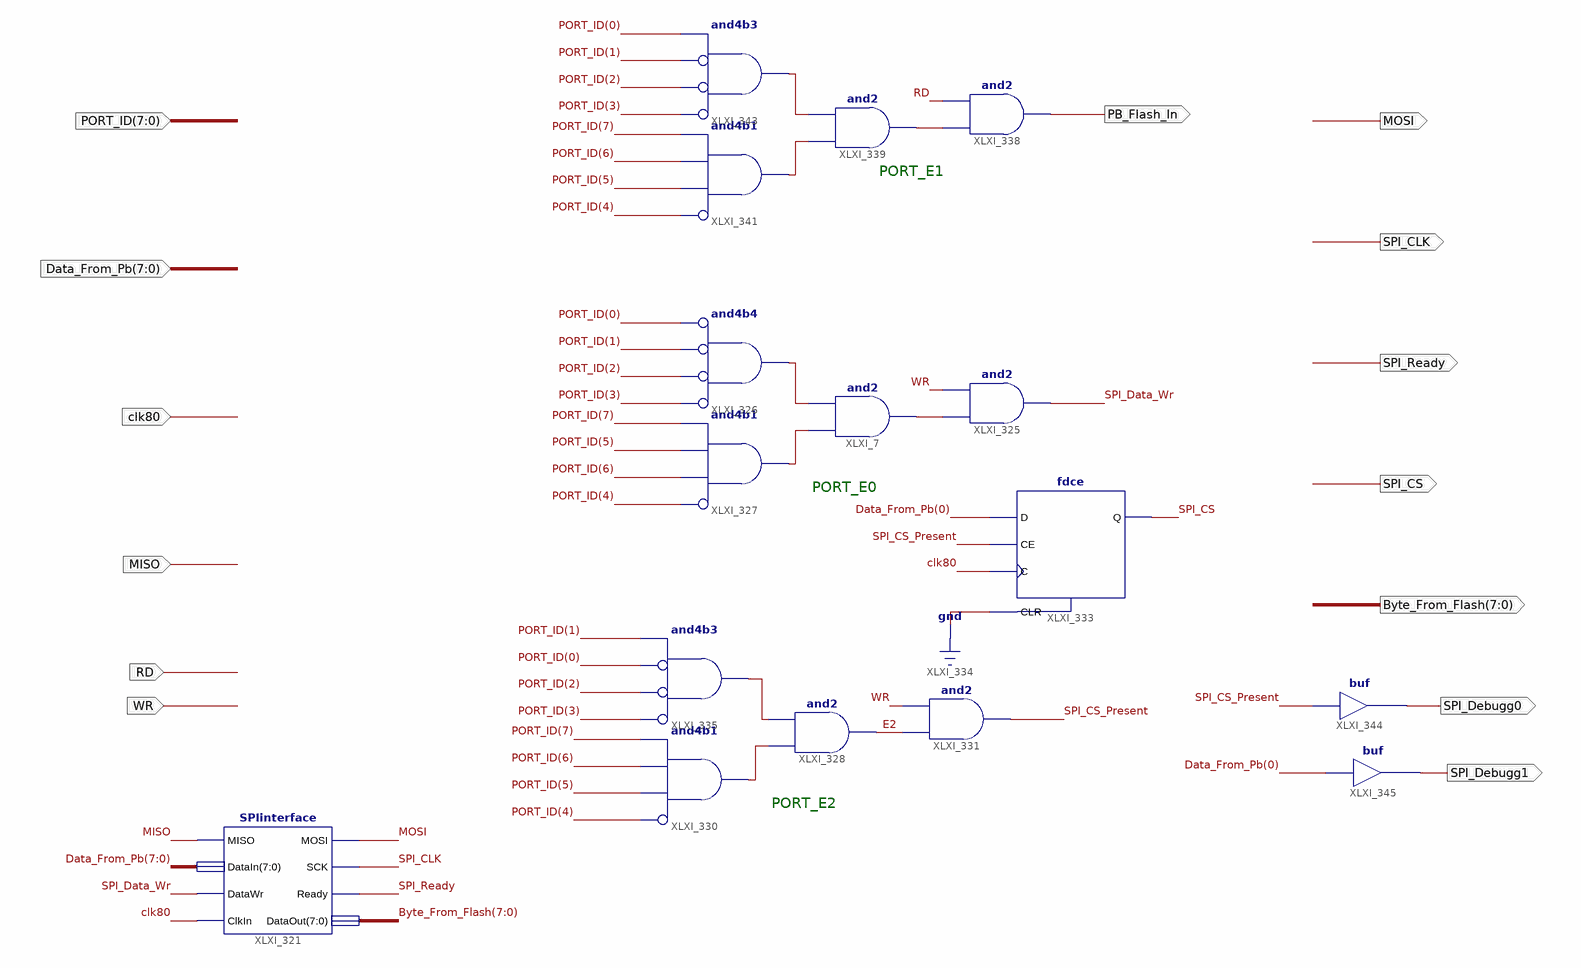
[diagram p0: schematic sheet 1]
// Xilinx ISE schematic SPI_Wraper.sch (spartan6) as structural Verilog: 16 symbols, 14 ports
module SPI_Wraper (
  input  [7:0] PORT_ID,
  input  [7:0] Data_From_Pb,
  input  clk80,
  input  RD,
  input  WR,
  input  MISO,
  output MOSI,
  output SPI_CLK,
  output SPI_CS,
  output [7:0] Byte_From_Flash,
  output SPI_Ready,
  output PB_Flash_In,
  output SPI_Debugg0,
  output SPI_Debugg1
);

  wire E2, SPI_CS_Present, SPI_Data_Wr, XLXN_32, XLXN_33, XLXN_34, XLXN_41, XLXN_42, XLXN_83, XLXN_84,
       XLXN_91;

  and XLXI_7 (XLXN_34, XLXN_33, XLXN_32);
  and XLXI_325 (SPI_Data_Wr, XLXN_34, WR);
  and XLXI_327 (XLXN_33, ~PORT_ID[4], PORT_ID[6], PORT_ID[5], PORT_ID[7]);  // and4b1
  and XLXI_328 (E2, XLXN_42, XLXN_41);
  and XLXI_330 (XLXN_42, ~PORT_ID[4], PORT_ID[5], PORT_ID[6], PORT_ID[7]);  // and4b1
  and XLXI_331 (SPI_CS_Present, E2, WR);
  fdce #(.INIT("1")) XLXI_333 (.C(clk80), .CE(SPI_CS_Present), .CLR(1'b0), .D(Data_From_Pb[0]), .Q(SPI_CS));
  SPIinterface XLXI_321 (
    .DataWr(SPI_Data_Wr), .DataIn(Data_From_Pb), .MISO(MISO), .ClkIn(clk80), .SCK(SPI_CLK),
    .Ready(SPI_Ready), .MOSI(MOSI), .DataOut(Byte_From_Flash));
  and XLXI_338 (PB_Flash_In, XLXN_91, RD);
  and XLXI_339 (XLXN_91, XLXN_84, XLXN_83);
  and XLXI_341 (XLXN_84, ~PORT_ID[4], PORT_ID[5], PORT_ID[6], PORT_ID[7]);  // and4b1
  and XLXI_326 (XLXN_32, ~PORT_ID[3], ~PORT_ID[2], ~PORT_ID[1], ~PORT_ID[0]);  // and4b4
  and XLXI_343 (XLXN_83, ~PORT_ID[3], ~PORT_ID[2], ~PORT_ID[1], PORT_ID[0]);  // and4b3
  buf XLXI_344 (SPI_Debugg0, SPI_CS_Present);
  buf XLXI_345 (SPI_Debugg1, Data_From_Pb[0]);
  and XLXI_335 (XLXN_41, ~PORT_ID[3], ~PORT_ID[2], ~PORT_ID[0], PORT_ID[1]);  // and4b3

  // Notes on the sheet:
  //   PORT_E1
  //   PORT_E0
  //   PORT_E2
endmodule
